# Altium schematic sheet HoloCubicPower_211230.SchDoc
size A4
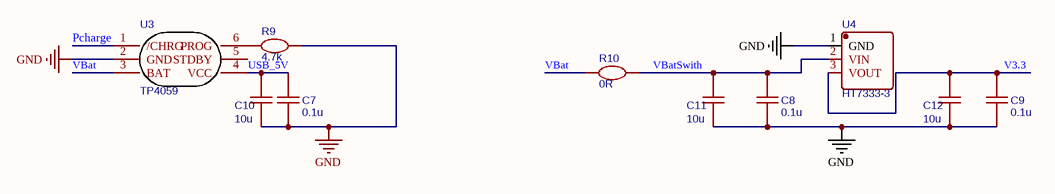
[diagram p0: HoloCubicPower_211230.SchDoc]

## Parts
C7  0.1u  [C0603]
C8  0.1u  [C0603]
C9  0.1u  [C0603]
C10  10u  [C0603]
C11  10u  [C0603]
C12  10u  [C0603]
R9  4.7k  [R0603]
R10  0R  [R0805]
U3  TP4059  [SOT-23-6]
U4  HT7333-3  [SOT-89]

## Nets
GND: C7.1 C8.1 C9.1 C10.1 C11.1 C12.1 R9.1 U3.2(GND) U4.1(GND)
Pcharge: U3.1(/CHRG)
USB_5V: C7.2 C10.2 U3.4(VCC)
V3.3: C9.2 C12.2 U4.3(VOUT)
VBat: R10.2 U3.3(BAT)
VBatSwith: C8.2 C11.2 R10.1 U4.2(VIN)
NetR9_2: R9.2 U3.6(PROG)

Not connected (* = marked no-connect by the designer): U3 5(STDBY)

## Library data of the parts
C7-C12 = 0.1u: nameAlias: Value(F); Contributor: LCEDA_Lib; spicePre: C; spiceSymbolName: C_0603_US
R9 R10 = 10k: Contributor: LCEDA_Lib; spicePre: R; spiceSymbolName: R_0603_EU
U3 = TP4059: BOM_Manufacturer: TOPPOWER; BOM_Supplier: LCSC; BOM_Manufacturer Part: TP4059; BOM_Supplier Part: C80364; BOM_JLCPCB Part Class: Extended Part; spicePre: U; spiceSymbolName: TP4059
U4 = HT7333-3: BOM_Manufacturer: HOLTEK; BOM_Supplier: LCSC; BOM_Manufacturer Part: HT7333-3; BOM_Supplier Part: C84207; BOM_JLCPCB Part Class: Extended Part; spicePre: U; spiceSymbolName: HT7333-3